# EAGLE design Startgate Controller Daughterboard (EAGLE 7.7.0)
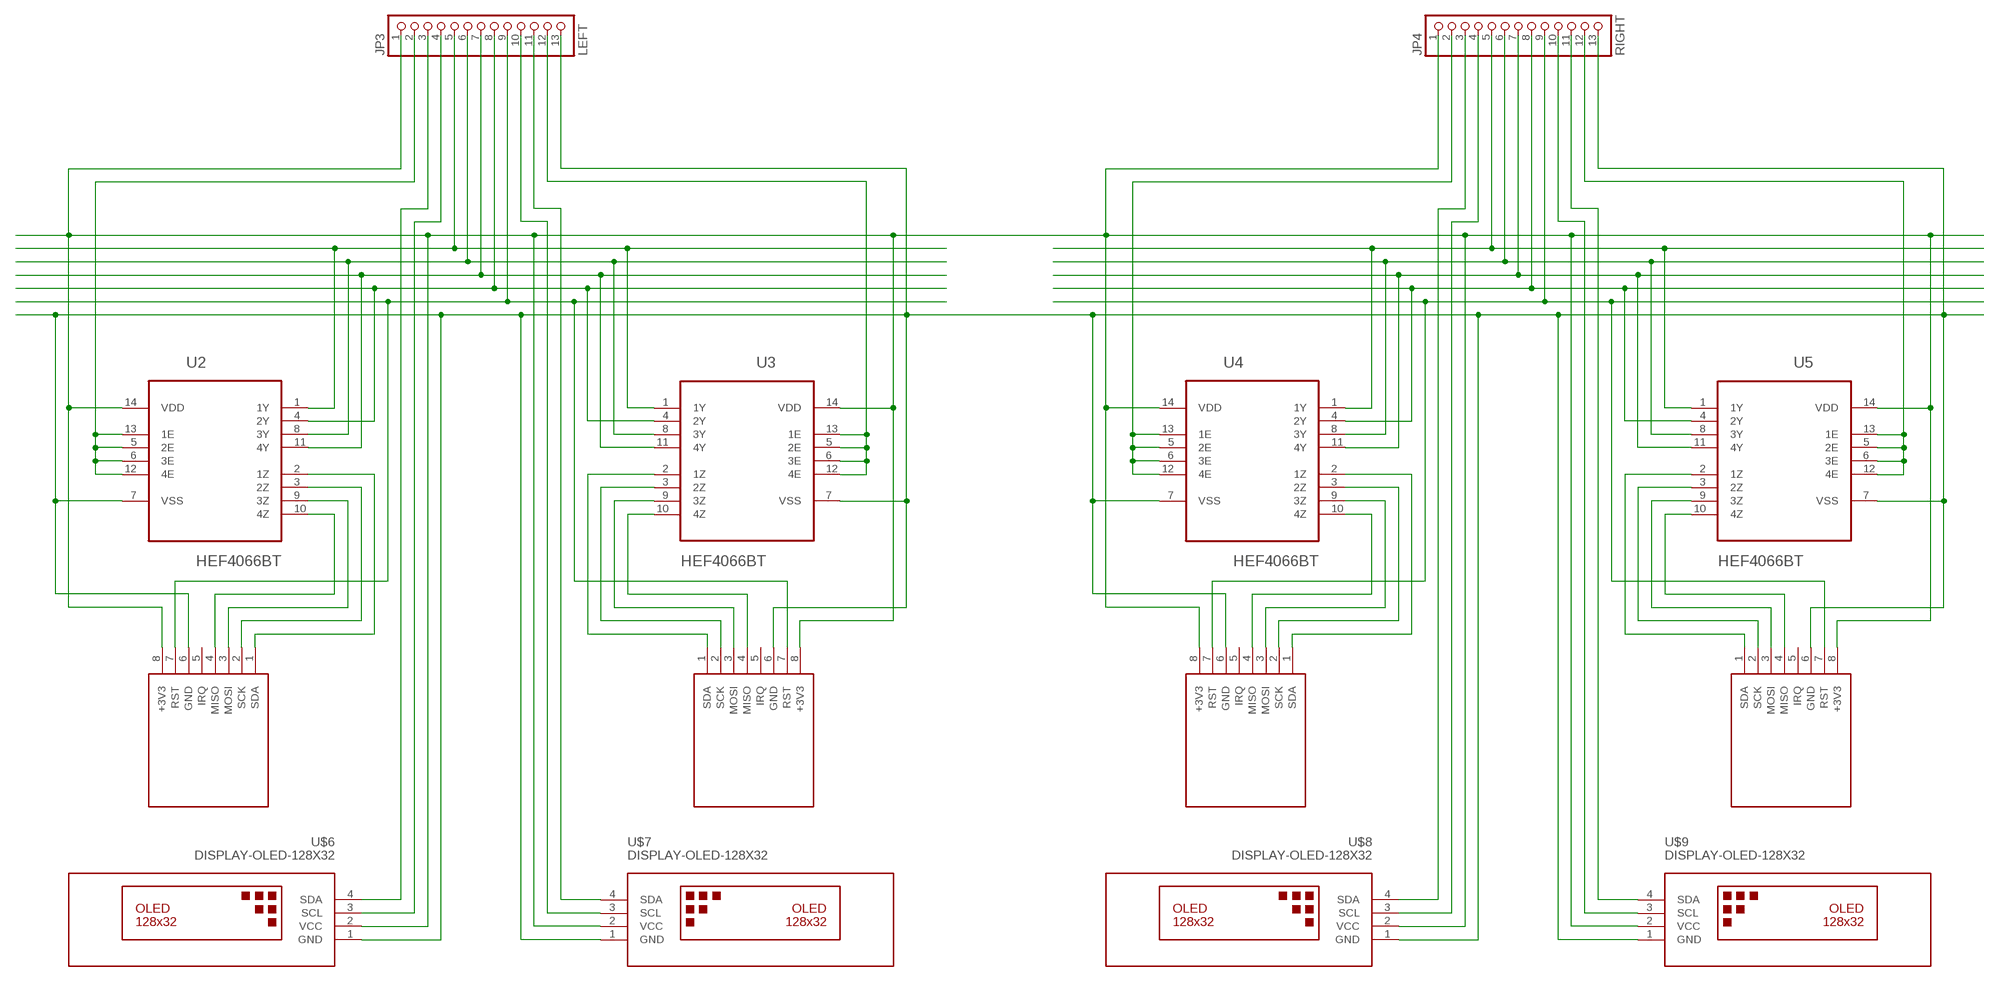
[diagram p0: schematic, sheet 1]

## Parts
JP3  LEFT  PINHD-1X13  [1X13]
JP4  RIGHT  PINHD-1X13  [1X13]
U2  HEF4066BT  [SOIC127P600X175-14N]
U3  HEF4066BT  [SOIC127P600X175-14N]
U4  HEF4066BT  [SOIC127P600X175-14N]
U5  HEF4066BT  [SOIC127P600X175-14N]
U$2  RFID-RC522  [RFID-RC522]
U$3  RFID-RC522  [RFID-RC522]
U$4  RFID-RC522  [RFID-RC522]
U$5  RFID-RC522  [RFID-RC522]
U$6  DISPLAY-OLED-128X32  [DISPLAY-OLED-128X32]
U$7  DISPLAY-OLED-128X32  [DISPLAY-OLED-128X32]
U$8  DISPLAY-OLED-128X32  [DISPLAY-OLED-128X32]
U$9  DISPLAY-OLED-128X32  [DISPLAY-OLED-128X32]

## Nets
+3V3: JP3.1 JP4.1 U2.14(VDD) U3.14(VDD) U4.14(VDD) U5.14(VDD) U$2.8(+3V3) U$3.8(+3V3) U$4.8(+3V3) U$5.8(+3V3) U$6.2(VCC) U$7.2(VCC) U$8.2(VCC) U$9.2(VCC)
ENA1: JP3.2 U2.5(2E) U2.6(3E) U2.12(4E) U2.13(1E)
ENA2: JP3.12 U3.5(2E) U3.6(3E) U3.12(4E) U3.13(1E)
ENA3: JP4.2 U4.5(2E) U4.6(3E) U4.12(4E) U4.13(1E)
GND: JP3.13 JP4.13 U2.7(VSS) U3.7(VSS) U4.7(VSS) U5.7(VSS) U$2.6(GND) U$3.6(GND) U$4.6(GND) U$5.6(GND) U$6.1(GND) U$7.1(GND) U$8.1(GND) U$9.1(GND)
MISO: JP4.7 U4.11(4Y) U5.11(4Y)
MISO-OUT1: U2.10(4Z) U$2.4(MISO)
MISO-OUT2: U3.10(4Z) U$3.4(MISO)
MISO-OUT3: U4.10(4Z) U$4.4(MISO)
MISO-OUT4: U5.10(4Z) U$5.4(MISO)
MOSI: JP4.6 U4.8(3Y) U5.8(3Y)
MOSI-OUT1: U2.9(3Z) U$2.3(MOSI)
MOSI-OUT2: U3.9(3Z) U$3.3(MOSI)
MOSI-OUT3: U4.9(3Z) U$4.3(MOSI)
MOSI-OUT4: U5.9(3Z) U$5.3(MOSI)
N$3: JP3.6 U2.8(3Y) U3.8(3Y)
N$7: JP3.5 U2.1(1Y) U3.1(1Y)
N$8: JP3.7 U2.11(4Y) U3.11(4Y)
N$14: JP3.8 U2.4(2Y) U3.4(2Y)
N$41: JP4.12 U5.5(2E) U5.6(3E) U5.12(4E) U5.13(1E)
RST: JP3.9 JP4.9 U$2.7(RST) U$3.7(RST) U$4.7(RST) U$5.7(RST)
SCK: JP4.8 U4.4(2Y) U5.4(2Y)
SCK-OUT1: U2.3(2Z) U$2.2(SCK)
SCK-OUT2: U3.3(2Z) U$3.2(SCK)
SCK-OUT3: U4.3(2Z) U$4.2(SCK)
SCK-OUT4: U5.3(2Z) U$5.2(SCK)
SCL1: JP3.4 U$6.3(SCL)
SCL2: JP3.10 U$7.3(SCL)
SCL3: JP4.4 U$8.3(SCL)
SCL4: JP4.10 U$9.3(SCL)
SDA1: JP3.3 U$6.4(SDA)
SDA2: JP3.11 U$7.4(SDA)
SDA3: JP4.3 U$8.4(SDA)
SDA4: JP4.11 U$9.4(SDA)
SS: JP4.5 U4.1(1Y) U5.1(1Y)
SS-OUT1: U2.2(1Z) U$2.1(SDA)
SS-OUT2: U3.2(1Z) U$3.1(SDA)
SS-OUT3: U4.2(1Z) U$4.1(SDA)
SS-OUT4: U5.2(1Z) U$5.1(SDA)
Unconnected: U$2.5(IRQ) U$3.5(IRQ) U$4.5(IRQ) U$5.5(IRQ)

## Library data of the parts
JP3 JP4 = pinhead:PINHD-1X13: PIN HEADER
U2-U5 = NXP_By_element14_Batch_1:HEF4066BT: Quad single-pole single-throw analog switch; MPN: HEF4066BT; OC_FARNELL: 1085287; OC_NEWARK: 97K1294; PACKAGE: SOIC-14; SUPPLIER: NXP
U$2-U$5 = miro:RFID-RC522: RC522 is a simple, low cost RFID reader module.
U$6-U$9 = diy-modules:DISPLAY-OLED-128X32: 128x32 Dot Matrix OLED Module with I2C interface based on SSD1306 chip More details available here: http://www.tinyosshop.com/index.php?route=product/product&product_id=953 Schematic available here: http://www.tinyosshop.com/datasheet/OLED%2012832.pdf SSD1306 datasheet: https://cdn-shop.adafruit.com/datasheets/SSD1306.pdf Click here to find device on ebay.com <http://www.ebay.com/sch/oled+display+128x32+i2c>

## Board
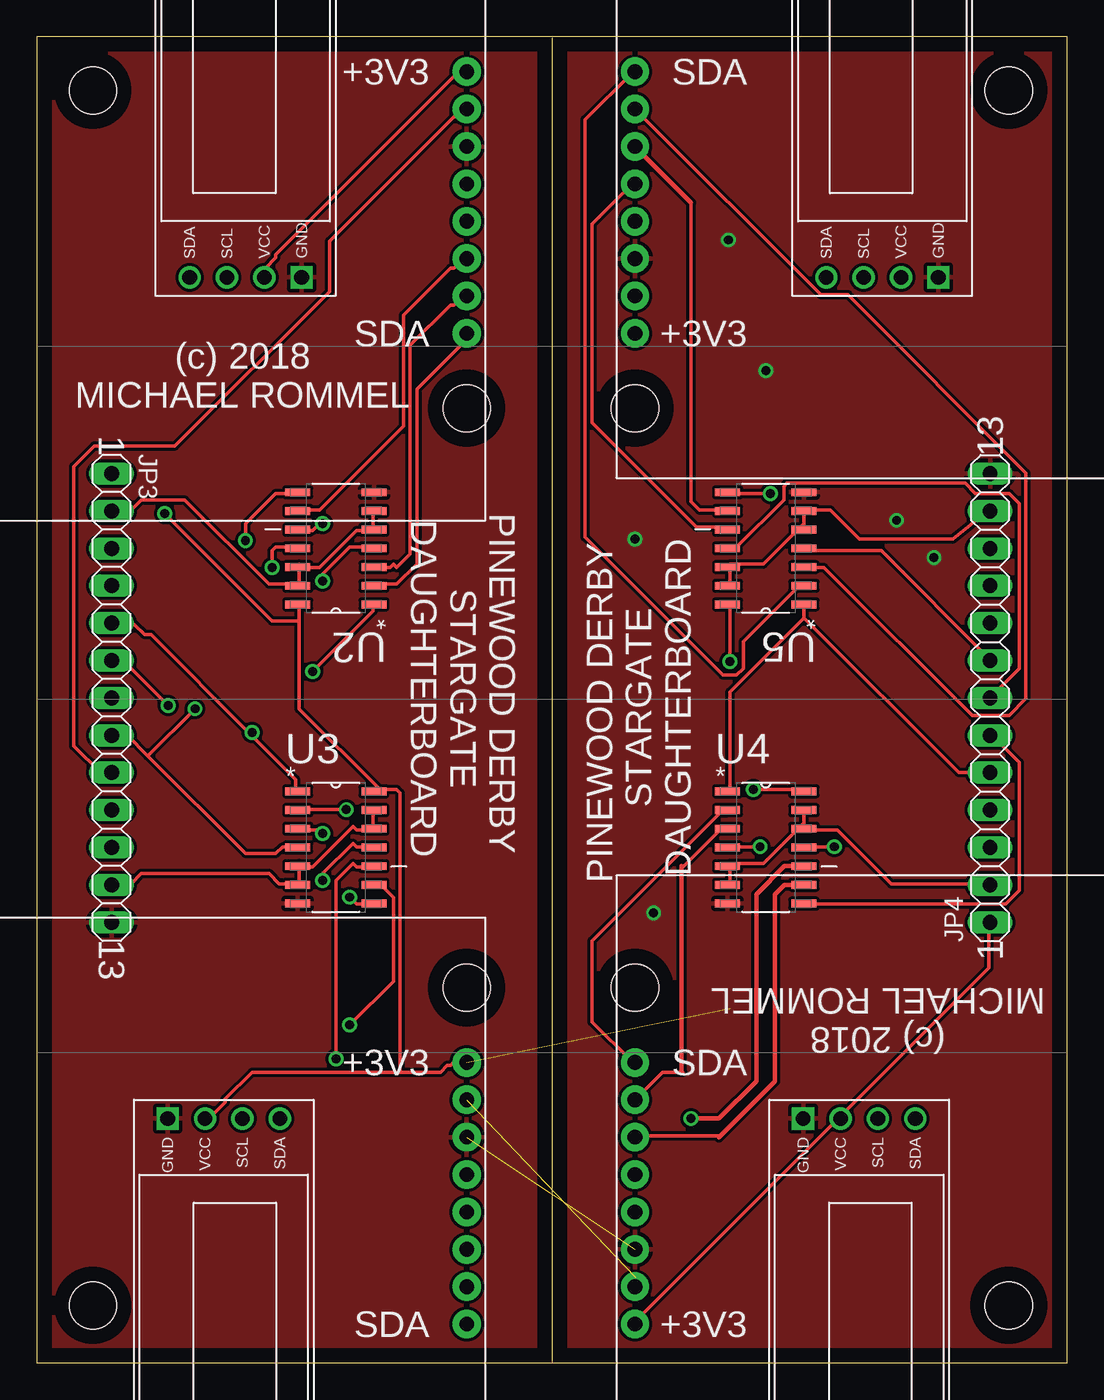
[diagram p1: board, top side]
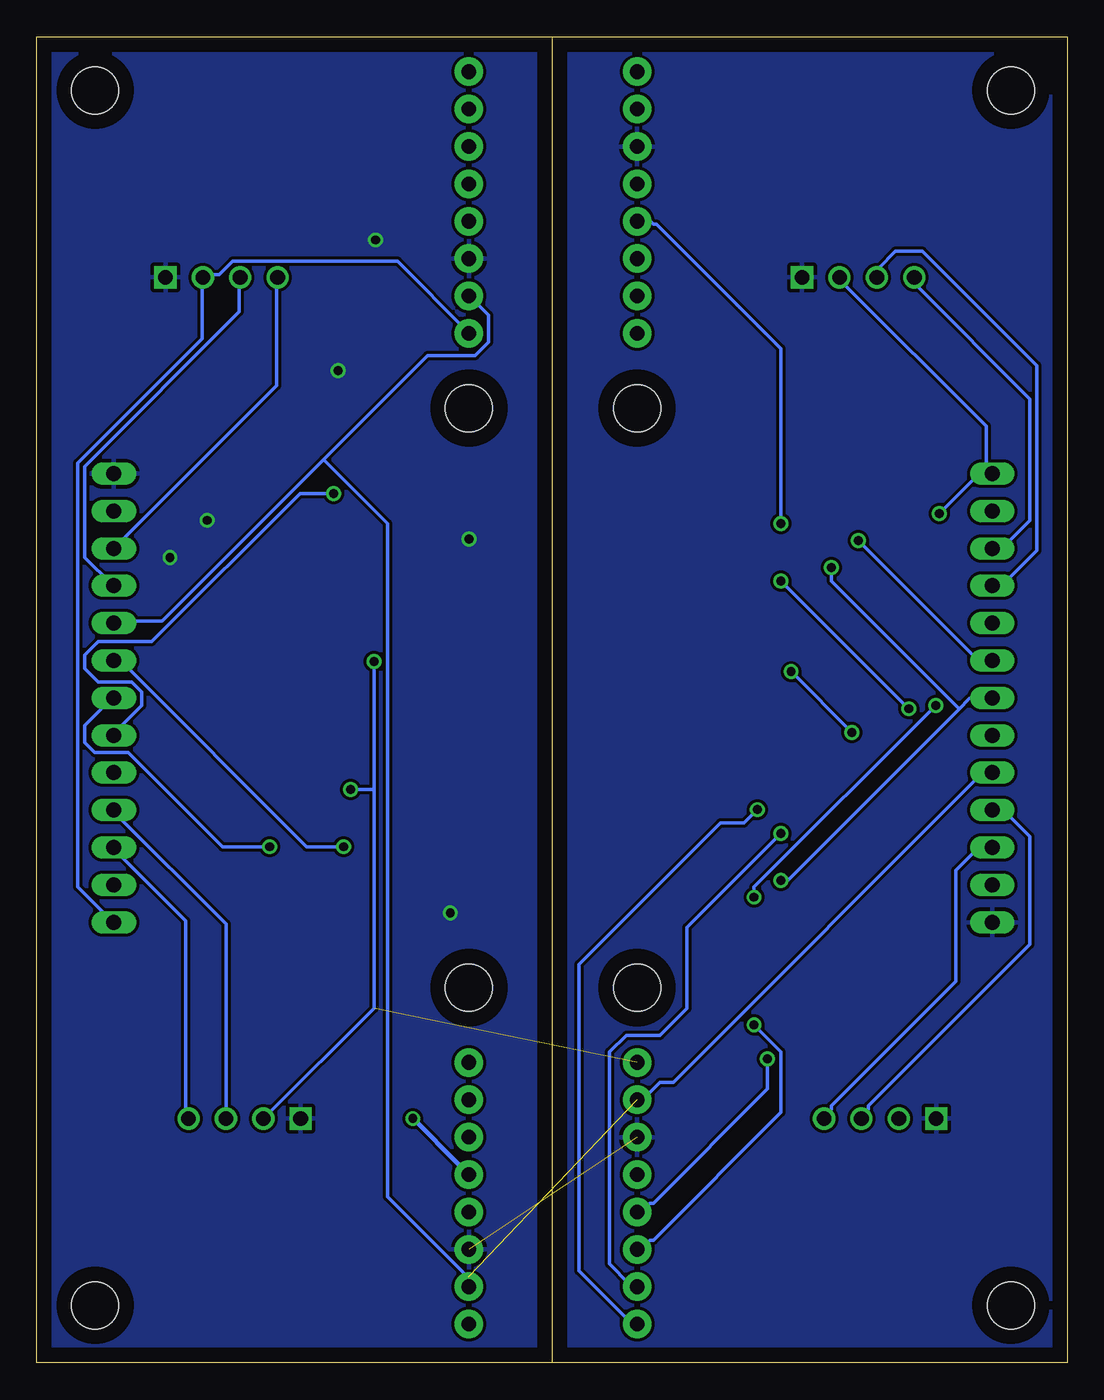
[diagram p2: board, bottom side, seen from below]

Size 70 x 90.08 mm. Coordinates in mm from the lower left corner, seen from the top.
Outline: 35,90 35,0
Outline: 0,0 70,0 70,90.08 0,90.08 0,0
Copper layers (1*16): Top 0.035mm / dielectric 1.5mm / Bottom 0.035mm
Design rules "default": minimum track width 10mil, minimum drill 24mil, track to track 8mil, track to pad 8mil, pad to pad 8mil, via to via 8mil, smd to smd 8mil, copper to edge 40mil, drill to drill 8mil, minimum pad ring 10mil, minimum via ring 8mil, stop-mask expansion 4mil, vias tented up to drill 0mil, thermal gap 10mil
Holes 3.2 mm at 29.21,64.85 29.21,25.48 3.81,3.89 3.81,86.44 66.04,86.44 40.64,64.85 40.64,25.48 66.04,3.89

### Footprints (pad centres in the part's own frame; a part is rotated, then mirrored left to right if it is on the bottom)
1X13 = drill 1.016 long: 1 -15.24,0; 2 -12.7,0; 3 -10.16,0; 4 -7.62,0; 5 -5.08,0; 6 -2.54,0; 7 0,0; 8 2.54,0; 9 5.08,0; 10 7.62,0; 11 10.16,0; 12 12.7,0; 13 15.24,0
SOIC127P600X175-14N = smd 1.702 x 0.533: 1 -2.591,3.81; 2 -2.591,2.54; 3 -2.591,1.27; 4 -2.591,0; 5 -2.591,-1.27; 6 -2.591,-2.54; 7 -2.591,-3.81; 8 2.591,-3.81; 9 2.591,-2.54; 10 2.591,-1.27; 11 2.591,0; 12 2.591,1.27; 13 2.591,2.54; 14 2.591,3.81
RFID-RC522 = drill 1 pad 1.93: 1 12.7,1.27; 2 15.24,1.27; 3 17.78,1.27; 4 20.32,1.27; 5 22.86,1.27; 6 25.4,1.27; 7 27.94,1.27; 8 30.48,1.27
DISPLAY-OLED-128X32 = drill 1 square: 1 -17.78,-3.81 | drill 1: 2 -17.78,-1.27; 3 -17.78,1.27; 4 -17.78,3.81

### Placement (x,y rotation side)
JP3  5.08,45.16 270 top
JP4  64.77,45.16 90 top
U2  20.32,55.32 180 top
U3  20.32,35 0 top
U4  49.53,35 0 top
U5  49.53,55.32 180 top
U$2  30.48,57.23 90 top
U$3  30.48,-10.08 90 top
U$4  39.37,33.1 270 top
U$5  39.37,100.41 270 top
U$6  14.19,91.52 90 top
U$7  12.7,-1.19 270 top
U$8  55.88,-1.19 270 top
U$9  57.45,91.52 90 top

### Tracks (layer width: path | path; a pad name or v marks a point on that pad's centre or on a via)
+3V3  (via drill 0.61)  (1 unrouted)
  Top 0.254: 17.83,50.37 17.83,44.43 23.32,38.94 | 17.83,50.37 17.83,51.52 U2.14 | 23.32,38.94 23.09,38.71 U3.14 23.32,38.94 | 24.69,19.74 27.43,19.74 27.89,20.2 28.12,20.2 28.35,20.42 29.03,20.42 U$3.8 | 24.69,19.74 14.63,19.74 12.8,17.91 12.8,17.68 11.89,16.77 11.43,16.77 U$7.2 | 23.32,38.94 24.46,38.94 24.69,38.71 24.69,19.74 | U$2.8 29.03,87.63 28.57,87.63 16.23,75.29 16.23,75.06 15.54,74.38 15.54,73.92 U$6.2 | 17.83,50.37 16,50.37 v8.69,57.69 | v47.09,47.63 47.09,51.52 U5.14 | v48.69,38.94 52.12,38.94 U4.14 | JP4.1 64.69,29.8 64.69,26.83 54.63,16.77 U$8.2 54.41,16.54 40.69,2.82 U$4.8
  Bottom 0.254: 5.49,60.89 5.49,60.66 5.26,60.43 JP3.1 5.49,60.89 | 5.49,60.89 5.49,63.63 15.32,73.46 15.32,73.69 U$6.2 | 5.49,60.89 v8.69,57.69 | U$5.8 40.69,70.03 45.49,74.83 56.69,74.83 57.61,73.92 58.52,73.92 U$9.2 58.75,73.69 58.75,69.57 67.21,61.12 67.21,32.31 64.92,30.03 JP4.1 | 47.09,38.94 47.09,24.08 54.41,16.77 U$8.2 | 47.09,38.94 v47.09,47.63 | 47.09,38.94 v48.69,38.94
ENA1
  Top 0.254: 18.06,54.03 17.83,53.8 17.83,52.89 U2.13 17.6,52.89 15.77,52.89 10.06,58.6 7.09,58.6 6.4,57.92 5.26,57.92 JP3.2 | 18.06,54.03 17.83,54.26 U2.12 18.06,54.03 | U2.6 22.86,57.69 22.86,56.77 U2.5 22.86,56.54 21.72,56.54 19.2,54.03 18.06,54.03
ENA2
  Top 0.254: 18.06,33.68 17.83,33.46 17.83,32.54 U3.6 17.6,32.54 16.46,32.54 15.77,33.23 7.09,33.23 6.4,32.54 5.26,32.54 JP3.12 | 18.06,33.68 17.83,33.91 U3.5 18.06,33.68 | U3.13 22.86,37.34 22.86,36.43 U3.12 22.86,36.2 21.72,36.2 21.49,36.43 18.75,33.68 18.06,33.68
ENA3
  Top 0.254: U4.6 47.09,32.54 47.09,33.68 U4.5 47.09,33.91 49.38,33.91 52.12,36.66 | U4.13 52.12,36.66 | 52.12,36.66 U4.12 52.12,36.2 54.41,36.2 58.06,32.54 64.69,32.54 JP4.2
GND  (via drill 0.6)  (1 unrouted)
  Top 0.254: 49.61,67.52 v49.53,67.39 | 42.06,30.71 v41.91,30.56
  other vias: 58.42,57.23 60.96,54.69 40.64,55.96 46.99,76.28
  pour Bottom: 0,90.25 69.85,90.25 69.85,0.08 0,0.08
  pour Top: 0,90.25 69.85,90.25 69.85,0.08 0,0.08
MISO  (via drill 0.61)
  Top 0.254: v54.18,35.06 52.12,35.06 U4.11 | U5.11 47.09,55.4 47.55,55.4 50.75,58.6 50.75,59.52 50.98,59.74 63.09,59.74 63.78,59.06 66.06,59.06 66.75,58.37 66.75,47.17 64.92,45.34 JP4.7
  Bottom 0.254: v54.18,35.06 57.38,35.06 63.78,41.46 66.06,41.46 66.75,42.14 66.75,43.28 64.92,45.11 JP4.7
MISO-OUT1  (via drill 0.61)
  Top 0.254: v19.43,57 19.2,57 18.75,56.54 17.83,56.54 U2.10
  Bottom 0.254: v19.43,57 19.43,68.89 27.89,77.35 28.12,77.35 28.35,77.58 29.03,77.58 U$2.4
MISO-OUT2  (via drill 0.61)
  Top 0.254: v20.34,20.65 20.34,32.77 21.49,33.91 21.72,33.68 22.86,33.68 U3.10
  Bottom 0.254: v20.34,20.65 20.34,18.6 28.12,10.82 28.35,10.82 29.03,10.14 U$3.4
MISO-OUT3  (via drill 0.6)
  Top 0.305: U4.10 50.8,33.73 48.9,31.83 48.9,19.13 46.35,16.59 v44.45,16.59
  Bottom 0.254: U$4.4 40.69,12.88 41.15,13.34 41.27,13.42
  Bottom 0.305: v44.45,16.59 41.27,13.42
MISO-OUT4
  Top 0.254: U5.10 46.86,56.77 44.81,56.77 37.72,63.86 37.72,77.35 40.46,80.09 U$5.4
MOSI  (via drill 0.61)
  Top 0.254: U4.8 52.12,31.17 65.84,31.17 66.75,32.08 66.75,40.77 64.92,42.6 JP4.6 | v49.84,59.06 47.09,59.06 U5.8
  Bottom 0.254: v49.84,59.06 52.12,59.06 62.18,49 65.84,49 66.75,48.09 66.75,47.17 65.84,46.26 63.55,46.26 62.87,45.57 62.87,44.66 64.69,42.83 JP4.6
MOSI-OUT1
  Top 0.254: U2.9 17.83,57.92 19.2,57.92 24.92,63.63 24.92,71.17 28.12,74.38 28.35,74.38 29.03,75.06 U$2.3
MOSI-OUT2  (via drill 0.61)
  Top 0.254: v21.26,22.94 24.23,25.91 24.23,31.63 23.32,32.54 23.09,32.54 U3.9
  Bottom 0.254: v21.26,22.94 19.43,21.11 19.43,17 28.12,8.31 28.35,8.31 29.03,7.62 U$3.3
MOSI-OUT3
  Top 0.254: U$4.3 40.69,15.4 46.41,15.4 46.42,15.38
  Top 0.305: U4.9 50.8,32.46 50.16,31.83 50.16,19.13 46.42,15.38 46.35,15.32
MOSI-OUT4
  Top 0.254: 44.45,78.82 44.45,58.5 45.03,57.92 46.86,57.92 U5.9 | 40.69,82.61 U$5.3
  Top 0.305: 44.45,78.82 U$5.3
N$3  (via drill 0.61)
  Top 0.254: v21.26,31.63 21.72,31.17 22.86,31.17 U3.8 | v8.91,44.66 5.94,47.63 5.26,47.63 JP3.6 | v14.17,55.86 14.17,57 16.23,59.06 17.6,59.06 U2.8
  Bottom 0.254: v21.26,31.63 21.26,32.31 v8.91,44.66 | v14.17,55.86 6.17,47.86 5.26,47.86 JP3.6
N$7  (via drill 0.61)
  Top 0.254: 14.4,42.83 7.77,49.46 7.32,49.46 6.63,50.14 5.26,50.14 JP3.5 | 14.4,42.83 17.6,39.63 17.6,38.94 U3.1 | v18.75,46.94 22.86,51.06 22.86,51.52 U2.1 | 14.4,42.83 v14.63,42.83
  Bottom 0.254: v14.63,42.83 v18.75,46.94
N$8  (via drill 0.61)
  Top 0.254: v19.43,32.77 19.43,33.23 21.49,35.28 21.72,35.06 22.86,35.06 U3.11 | v16,54.03 16,55.17 16.23,55.4 17.6,55.4 U2.11
  Bottom 0.254: v19.43,32.77 18.97,32.77 7.32,44.43 | 7.32,44.43 6.63,45.11 5.26,45.11 JP3.7 | v16,54.03 16,53.11 7.32,44.43
N$14  (via drill 0.61)
  Top 0.254: 7.54,41.23 6.17,42.6 5.26,42.6 JP3.8 | 7.54,41.23 14.17,34.6 16.23,34.6 16.69,35.06 17.6,35.06 U3.4 | v19.43,53.11 19.43,53.57 21.26,55.4 22.86,55.4 U2.4 | 7.54,41.23 v10.74,44.43
  Bottom 0.254: v10.74,44.43 v19.43,53.11
N$41
  Top 0.254: U5.13 47.09,52.89 47.09,54.03 U5.12 47.09,54.26 49.38,54.26 52.12,57 | 52.12,57 U5.6 52.12,57.92 53.92,57.92 55.88,55.96 62.23,55.96 64.69,57.92 JP4.12 | 52.12,57 U5.5
RST  (1 unrouted)
  Top 0.254: JP3.9 4.34,40.09 2.52,41.91 2.52,60.89 3.89,62.26 9.37,62.26 19.89,72.77 19.89,76.2 28.35,84.66 28.57,84.66 29.03,85.12 U$2.7
  Bottom 0.254: 50.52,61.34 43.43,68.43 40.23,68.43 39.32,69.35 39.32,71.17 40.46,72.32 U$5.7 | 50.52,61.34 61.49,50.37 64.69,50.37 JP4.9 | 50.52,61.34 46.18,57 46.18,11.28 40.69,5.79 40.69,5.34 U$4.7 | JP3.9 5.71,40.09 26.75,19.05 27.66,19.05 29.03,17.68 U$3.7
SCK  (via drill 0.61)
  Top 0.254: v49.15,35.06 47.09,35.06 U4.4 | U5.4 52.12,55.17 57.38,55.17 64.69,47.86 JP4.8
  Bottom 0.254: v49.15,35.06 51.66,35.06 64.24,47.63 64.69,47.63 JP4.8
SCK-OUT1
  Top 0.254: U2.3 23.09,54.03 24,54.03 24.23,54.26 24.46,54.03 25.38,54.94 25.38,69.12 28.12,71.86 28.35,71.86 29.03,72.55 U$2.2
SCK-OUT2  (via drill 0.61)
  Top 0.254: v19.43,35.97 19.2,36.2 17.83,36.2 U3.3
  Bottom 0.254: v19.43,35.97 25.83,29.57 25.83,24.08 27.66,22.25 29.95,22.25 31.09,21.11 31.09,6.71 29.72,5.34 29.26,5.34 U$3.2
SCK-OUT3
  Top 0.254: U4.3 46.86,36.2 46.41,36.2 43.89,33.68 43.81,33.68 | U$4.2 42.52,19.74 43.89,19.74 43.81,19.76
  Top 0.305: 43.81,33.73 43.81,33.68 43.81,19.76
SCK-OUT4
  Top 0.254: U$5.2 53.26,72.55 55.09,72.55 67.21,60.43 67.21,45.11 66.06,43.97 63.55,43.97 53.49,54.03 52.12,54.03 U5.3
SCL1
  Bottom 0.254: U$6.3 12.8,73.92 12.8,74.38 11.66,75.52 9.83,75.52 2.06,67.75 2.06,55.17 4.34,52.89 5.03,52.89 JP3.4
SCL2
  Bottom 0.254: U$7.3 13.95,16.77 13.49,17.22 13.49,17.45 2.52,28.43 2.52,35.74 4.12,37.34 5.03,37.34 JP3.10
SCL3
  Bottom 0.254: U$8.3 57.15,29.8 64.69,37.34 JP4.4
SCL4
  Bottom 0.254: U$9.3 56.24,73.69 56.24,71.4 66.75,60.89 66.75,54.71 64.92,52.89 JP4.10
SDA1
  Bottom 0.254: U$6.4 10.29,73.69 10.29,73.23 2.52,65.46 2.52,57.23 4.34,55.4 5.03,55.4 JP3.3
SDA2
  Bottom 0.254: U$7.4 16.46,16.77 16,17.22 16,17.45 7.54,25.91 7.54,33.46 6.17,34.83 5.26,34.83 JP3.11
SDA3
  Bottom 0.254: U$8.4 59.89,16.77 59.89,30.03 64.69,34.83 JP4.3
SDA4
  Bottom 0.254: JP4.11 53.72,66.37 53.72,73.69 U$9.4
SS
  Top 0.254: 52.12,50.6 47.09,45.57 47.09,38.94 U4.1 | U5.1 52.12,50.6 | JP4.5 62.64,40.09 52.12,50.6
SS-OUT1
  Top 0.254: U2.2 23.09,52.89 24.46,52.89 25.83,54.26 25.83,66.14 29.03,69.35 29.03,69.8 U$2.1
SS-OUT2  (via drill 0.61)
  Top 0.254: v21.03,37.57 17.83,37.57 U3.2
  Bottom 0.254: v21.03,37.57 21.95,36.66 23.55,36.66 33.15,27.05 33.15,6.25 29.72,2.82 29.26,2.82 U$3.1
SS-OUT3
  Top 0.254: U4.2 46.86,37.34 46.41,37.34 37.72,28.65 37.72,23.17 40.46,20.42 U$4.1
SS-OUT4
  Top 0.254: U5.2 52.12,52.66 51.66,52.66 48.01,49 48.01,47.17 47.55,46.71 46.63,46.71 37.26,56.09 37.26,84.43 40.46,87.63 U$5.1

### Text on the board
tNames: +3V3 | SDA | SDA | +3V3 | (c) 2018 / MICHAEL ROMMEL | 13 | 1 | PINEWOOD DERBY / STARGATE / DAUGHTERBOARD | PINEWOOD DERBY / STARGATE / DAUGHTERBOARD | 1 | 13 | (c) 2018 / MICHAEL ROMMEL | +3V3 | SDA | SDA | +3V3